# Altium project Guppy Buddy Rev B.PrjPCB (part 7 of 9)

## Sheet LCD.SchDoc: LCD
size Tabloid; ApprovedBy: NA; CompanyName: Cospan Design LLC; DrawnBy: David McCoy; Engineer: David McCoy; DocumentNumber: 11; Revision: A; SheetNumber: 11; SheetTotal: 18; Client: OSH; Project: Guppy Buddy; ProjectPrettyName: Guppy Buddy
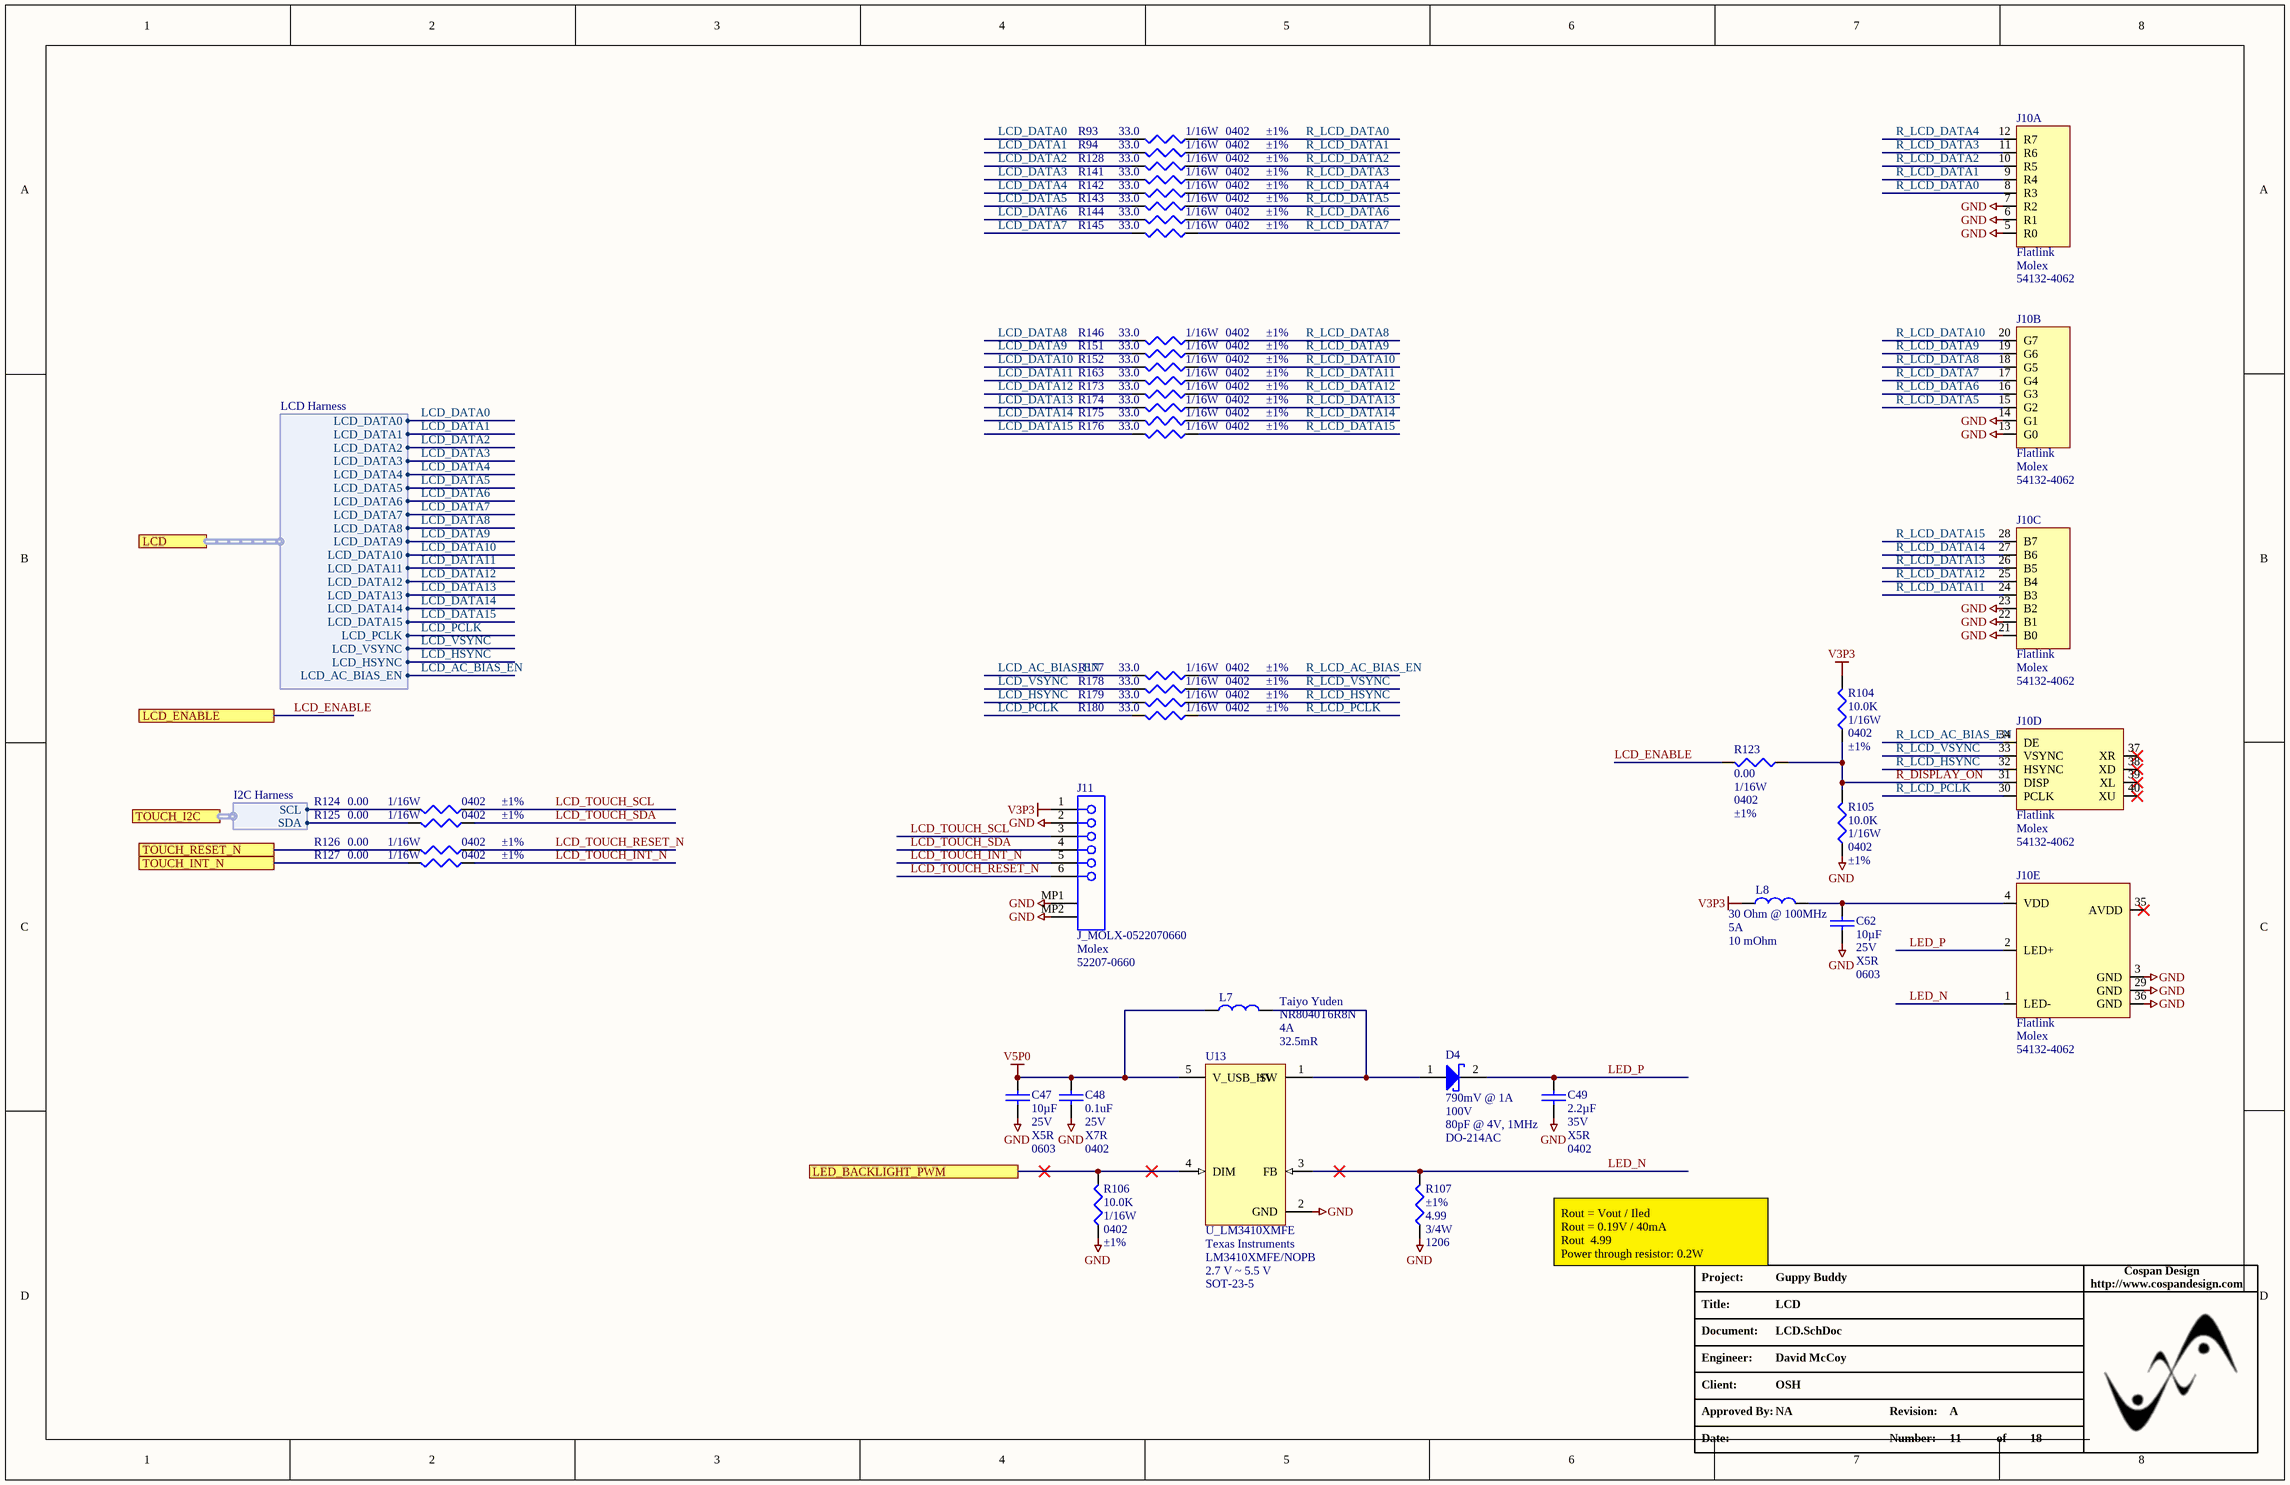
[diagram p10: LCD.SchDoc]

### Parts
C47  Capacitance: 10µF  Voltage - Rated: 25V  Temperature Coefficient: X5R  Package / Case: 0603  [C_ERA-0603]  (hidden comment: C_0603_10µF)
C48  Capacitance: 0.1uF  Voltage - Rated: 25V  Temperature Coefficient: X7R  Package / Case: 0402  [C_0402]  (hidden comment: C_0402_0.1UF_25V)
C49  Capacitance: 2.2µF  Voltage - Rated: 35V  Temperature Coefficient: X5R  Package / Case: 0402  [C_0402]  (hidden comment: C_0402_2.2uF_35V)
C62  Capacitance: 10µF  Voltage - Rated: 25V  Temperature Coefficient: X5R  Package / Case: 0603  [C_ERA-0603]  (hidden comment: C_0603_10µF)
D4  Voltage - Forward (Vf) (Max) @ If: 790mV @ 1A  Voltage - DC Reverse (Vr) (Max): 100V  Capacitance @ Vr, F: 80pF @ 4V, 1MHz  Package / Case: DO-214AC  [DIOM5226X23L]  (hidden comment: B1100-13-F)
J10  Flatlink  Manufacturer 1: Molex  Manufacturer Part Number 1: 54132-4062  [FPC_40PIN_BOTTOM]  (parts A,B,C,D,E of 5)
J11  J_MOLX-0522070660  Manufacturer 1: Molex  Manufacturer Part Number 1: 52207-0660  [MOLX-52271-0679]
L7  Manufacturer: Taiyo Yuden  Manufacturer Part Number: NR8040T6R8N  Max DC Current: 4A  DC Resistance (DCR): 32.5mR  [IND_TAIYO_NR8040]  (hidden comment: L_6.8µH_SHLD_4A)
L8  Impedance @ Frequency: 30 Ohm @ 100MHz  Current Rating (Max): 5A  DC Resistance (DCR) (Max): 10 mOhm  [R_0603]  (hidden comment: L_BEAD_0603_30OHM_100MHZ)
R93  Resistance In Ohms: 33.0  Power (Watts): 1/16W  Case: 0402  Tolerance: ±1%  [R_0402]  (hidden comment: R_0402_33)
R94  Resistance In Ohms: 33.0  Power (Watts): 1/16W  Case: 0402  Tolerance: ±1%  [R_0402]  (hidden comment: R_0402_33)
R104  Resistance In Ohms: 10.0K  Power (Watts): 1/16W  Case: 0402  Tolerance: ±1%  [R_0402]  (hidden comment: R_0402_10.0K)
R105  Resistance In Ohms: 10.0K  Power (Watts): 1/16W  Case: 0402  Tolerance: ±1%  [R_0402]  (hidden comment: R_0402_10.0K)
R106  Resistance In Ohms: 10.0K  Power (Watts): 1/16W  Case: 0402  Tolerance: ±1%  [R_0402]  (hidden comment: R_0402_10.0K)
R107  Tolerance: ±1%  Resistance In Ohms: 4.99  Power (Watts): 3/4W  Case: 1206  [R_1206]  (hidden comment: R_1206_4.99)
R123  Resistance In Ohms: 0.00  Power (Watts): 1/16W  Case: 0402  Tolerance: ±1%  [R_0402]  (hidden comment: 0.0 Ohms)
R124  Resistance In Ohms: 0.00  Power (Watts): 1/16W  Case: 0402  Tolerance: ±1%  [R_0402]  (hidden comment: 0.0 Ohms)
R125  Resistance In Ohms: 0.00  Power (Watts): 1/16W  Case: 0402  Tolerance: ±1%  [R_0402]  (hidden comment: 0.0 Ohms)
R126  Resistance In Ohms: 0.00  Power (Watts): 1/16W  Case: 0402  Tolerance: ±1%  [R_0402]  (hidden comment: 0.0 Ohms)
R127  Resistance In Ohms: 0.00  Power (Watts): 1/16W  Case: 0402  Tolerance: ±1%  [R_0402]  (hidden comment: 0.0 Ohms)
R128  Resistance In Ohms: 33.0  Power (Watts): 1/16W  Case: 0402  Tolerance: ±1%  [R_0402]  (hidden comment: R_0402_33)
R141  Resistance In Ohms: 33.0  Power (Watts): 1/16W  Case: 0402  Tolerance: ±1%  [R_0402]  (hidden comment: R_0402_33)
R142  Resistance In Ohms: 33.0  Power (Watts): 1/16W  Case: 0402  Tolerance: ±1%  [R_0402]  (hidden comment: R_0402_33)
R143  Resistance In Ohms: 33.0  Power (Watts): 1/16W  Case: 0402  Tolerance: ±1%  [R_0402]  (hidden comment: R_0402_33)
R144  Resistance In Ohms: 33.0  Power (Watts): 1/16W  Case: 0402  Tolerance: ±1%  [R_0402]  (hidden comment: R_0402_33)
R145  Resistance In Ohms: 33.0  Power (Watts): 1/16W  Case: 0402  Tolerance: ±1%  [R_0402]  (hidden comment: R_0402_33)
R146  Resistance In Ohms: 33.0  Power (Watts): 1/16W  Case: 0402  Tolerance: ±1%  [R_0402]  (hidden comment: R_0402_33)
R151  Resistance In Ohms: 33.0  Power (Watts): 1/16W  Case: 0402  Tolerance: ±1%  [R_0402]  (hidden comment: R_0402_33)
R152  Resistance In Ohms: 33.0  Power (Watts): 1/16W  Case: 0402  Tolerance: ±1%  [R_0402]  (hidden comment: R_0402_33)
R163  Resistance In Ohms: 33.0  Power (Watts): 1/16W  Case: 0402  Tolerance: ±1%  [R_0402]  (hidden comment: R_0402_33)
R173  Resistance In Ohms: 33.0  Power (Watts): 1/16W  Case: 0402  Tolerance: ±1%  [R_0402]  (hidden comment: R_0402_33)
R174  Resistance In Ohms: 33.0  Power (Watts): 1/16W  Case: 0402  Tolerance: ±1%  [R_0402]  (hidden comment: R_0402_33)
R175  Resistance In Ohms: 33.0  Power (Watts): 1/16W  Case: 0402  Tolerance: ±1%  [R_0402]  (hidden comment: R_0402_33)
R176  Resistance In Ohms: 33.0  Power (Watts): 1/16W  Case: 0402  Tolerance: ±1%  [R_0402]  (hidden comment: R_0402_33)
R177  Resistance In Ohms: 33.0  Power (Watts): 1/16W  Case: 0402  Tolerance: ±1%  [R_0402]  (hidden comment: R_0402_33)
R178  Resistance In Ohms: 33.0  Power (Watts): 1/16W  Case: 0402  Tolerance: ±1%  [R_0402]  (hidden comment: R_0402_33)
R179  Resistance In Ohms: 33.0  Power (Watts): 1/16W  Case: 0402  Tolerance: ±1%  [R_0402]  (hidden comment: R_0402_33)
R180  Resistance In Ohms: 33.0  Power (Watts): 1/16W  Case: 0402  Tolerance: ±1%  [R_0402]  (hidden comment: R_0402_33)
U13  U_LM3410XMFE  Manufacturer: Texas Instruments  Manufacturer Part Number: LM3410XMFE/NOPB  Voltage - Supply: 2.7 V ~ 5.5 V  Supplier Device Package: SOT-23-5  [MF05A_N]

### Ports
LCD (harness LCD Harness), LCD_ENABLE, LED_BACKLIGHT_PWM, TOUCH_I2C (harness I2C Harness), TOUCH_INT_N, TOUCH_RESET_N

### Harnesses
LCD Harness: LCD_DATA0, LCD_DATA1, LCD_DATA2, LCD_DATA3, LCD_DATA4, LCD_DATA5, LCD_DATA6, LCD_DATA7, LCD_DATA8, LCD_DATA9, LCD_DATA10, LCD_DATA11, LCD_DATA12, LCD_DATA13, LCD_DATA14, LCD_DATA15, LCD_PCLK, LCD_VSYNC, LCD_HSYNC, LCD_AC_BIAS_EN
I2C Harness: SCL, SDA

### Nets
GND: C47.1 C48.1 C49.1 C62.1 J10.3(GND) J10.5(R0) J10.6(R1) J10.7(R2) J10.13(G0) J10.14(G1) J10.21(B0) J10.22(B1) J10.23(B2) J10.29(GND) J10.36(GND) J11.2 J11.MP1 J11.MP2 R105.2 R106.2 R107.2 U13.2(GND)
V3P3: J11.1 L8.2 R104.1
V5P0: C47.2 C48.2 L7.1 U13.5(V_USB_HV)
I2C1_SCL: R124.1 ; port TOUCH_I2C.SCL
I2C1_SDA: R125.1 ; port TOUCH_I2C.SDA
LCD_AC_BIAS_EN: R177.1 ; port LCD.LCD_AC_BIAS_EN
LCD_DATA0: R93.1 ; port LCD.LCD_DATA0
LCD_DATA1: R94.1 ; port LCD.LCD_DATA1
LCD_DATA2: R128.1 ; port LCD.LCD_DATA2
LCD_DATA3: R141.1 ; port LCD.LCD_DATA3
LCD_DATA4: R142.1 ; port LCD.LCD_DATA4
LCD_DATA5: R143.1 ; port LCD.LCD_DATA5
LCD_DATA6: R144.1 ; port LCD.LCD_DATA6
LCD_DATA7: R145.1 ; port LCD.LCD_DATA7
LCD_DATA8: R146.1 ; port LCD.LCD_DATA8
LCD_DATA9: R151.1 ; port LCD.LCD_DATA9
LCD_DATA10: R152.1 ; port LCD.LCD_DATA10
LCD_DATA11: R163.1 ; port LCD.LCD_DATA11
LCD_DATA12: R173.1 ; port LCD.LCD_DATA12
LCD_DATA13: R174.1 ; port LCD.LCD_DATA13
LCD_DATA14: R175.1 ; port LCD.LCD_DATA14
LCD_DATA15: R176.1 ; port LCD.LCD_DATA15
LCD_ENABLE: R123.1 ; port LCD_ENABLE
LCD_HSYNC: R179.1 ; port LCD.LCD_HSYNC
LCD_PCLK: R180.1 ; port LCD.LCD_PCLK
LCD_TOUCH_INT_N: J11.5 R127.2
LCD_TOUCH_RESET_N: J11.6 R126.2
LCD_TOUCH_SCL: J11.3 R124.2
LCD_TOUCH_SDA: J11.4 R125.2
LCD_VSYNC: R178.1 ; port LCD.LCD_VSYNC
LED_BACKLIGHT_PWM: R106.1 U13.4(DIM) ; port LED_BACKLIGHT_PWM
LED_N: J10.1(LED-) R107.1 U13.3(FB)
LED_P: C49.2 D4.2(K) J10.2(LED+)
R_DISPLAY_ON: J10.31(DISP) R104.2 R105.1 R123.2
R_LCD_AC_BIAS_EN: J10.34(DE) R177.2
R_LCD_DATA0: J10.8(R3) R93.2
R_LCD_DATA1: J10.9(R4) R94.2
R_LCD_DATA2: J10.10(R5) R128.2
R_LCD_DATA3: J10.11(R6) R141.2
R_LCD_DATA4: J10.12(R7) R142.2
R_LCD_DATA5: J10.15(G2) R143.2
R_LCD_DATA6: J10.16(G3) R144.2
R_LCD_DATA7: J10.17(G4) R145.2
R_LCD_DATA8: J10.18(G5) R146.2
R_LCD_DATA9: J10.19(G6) R151.2
R_LCD_DATA10: J10.20(G7) R152.2
R_LCD_DATA11: J10.24(B3) R163.2
R_LCD_DATA12: J10.25(B4) R173.2
R_LCD_DATA13: J10.26(B5) R174.2
R_LCD_DATA14: J10.27(B6) R175.2
R_LCD_DATA15: J10.28(B7) R176.2
R_LCD_HSYNC: J10.32(HSYNC) R179.2
R_LCD_PCLK: J10.30(PCLK) R180.2
R_LCD_VSYNC: J10.33(VSYNC) R178.2
TOUCH_INT_N: R127.1 ; port TOUCH_INT_N
TOUCH_RESET_N: R126.1 ; port TOUCH_RESET_N
NetC62_2: C62.2 J10.4(VDD) L8.1
NetD4_1: D4.1(A) L7.2 U13.1(SW)

Not connected (* = marked no-connect by the designer): J10 35(AVDD)* 37(XR)* 38(XD)* 39(XL)* 40(XU)*

### Notes on the sheet
- Rout = Vout / Iled
  Rout = 0.19V / 40mA
  Rout  4.99
  Power through resistor: 0.2W
- Project:
- http://www.cospandesign.com
- Cospan Design
- Document:
- Engineer:
- Title:
- Client:
- Approved By:
- Revision:
- Date:
- Number:
- of

### Library data of the parts
C47 C62 = C_0603_10µF: CAP CER 10UF 16V X5R 0603; Manufacturer: Murata Electronics North America; Manufacturer Part Number: GRM188R61C106MA73D; Tolerance: ±20%; Supplier 1: Digi-Key; RoHS: RoHS Compliant; Category: Capacitors; Stock 1: 450536; Pricing 1: 1=0.35, 10=0.303, 50=0.184, 100=0.1516, 250=0.12124, 500=0.11042, 1000=0.09959 (USD); Packaging: Cut Tape (CT); Mounting Type: Surface Mount, MLCC; Operating Temperature: -55°C ~ 85°C; Applications: General Purpose; Ratings: -; Size / Dimension: 0.063" L x 0.031" W (1.60mm x 0.80mm); Height - Seated (Max): -; Thickness (Max): 0.031" (0.80mm); Lead Spacing: -; Features: -; Lead Style: -; ComponentLink1URL: http://www.murata.com/~/media/webrenewal/support/library/catalog/products/capacitor/mlcc/c02e.pdf; ComponentLink1Description: http://www.murata.com/~/media/webrenewal/support/library/catalog/products/capacitor/mlcc/c02e.pdf; Supplier Part Number 1: 490-7201-1-ND
C48 = C_0402_0.1UF_25V: CAP CER 0.1UF 25V X6S 0402; Manufacturer 1: Yageo; Manufacturer Part Number 1: CC0402KRX7R8BB104; Description 1: Cap Ceramic 0.1uF 25V X7R 10% SMD 0402 125C Paper T/R; Tolerance: 10%; Dissipation Factor: 3.5%; ComponentLink1URL: https://product.tdk.com/info/en/catalog/datasheets/mlcc_commercial_general_en.pdf; ComponentLink1Description: https://product.tdk.com/info/en/catalog/datasheets/mlcc_commercial_general_en.pdf; Supplier 1: Digi-Key; Supplier Part Number 1: 311-2077-1-ND; Stock 1: 0; Pricing 1: 1=0.1, 10=0.048, 100=0.0215, 500=0.01534, 1000=0.01205, 2500=0.01095, 5000=0.01007 (USD); Mount: Surface Mount; Case/Package: 0402; Case Code (Imperial): 0402; Case Code (Metric): 1005; Min Operating Temperature: -55°C; Max Operating Temperature: 125°C; Voltage Rating: 25V; Voltage Rating (DC): 25V; Packaging: Tape and Reel; Dielectric: X7R; Termination: SMD/SMT; Composition: Ceramic; Length: 1mm; Height: 0.5mm; Width: 0.02inch; Thickness: 0.022inch; Depth: 0.5mm; Radiation Hardening: No; Lead Free: Lead Free; Halogen Free: Halogen Free; ComponentLink2URL: https://datasheet.ciiva.com/11464/upy-gphc-x7r-6-3v-to-50v-8-11464889.pdf; ComponentLink2Description: https://datasheet.ciiva.com/11464/upy-gphc-x7r-6-3v-to-50v-8-11464889.pdf; ComponentLink3URL: https://datasheet.ciiva.com/13210/upy-gphc-x7r-6-3v-to-50v-8-12304-13210908.pdf; ComponentLink3Description: https://datasheet.ciiva.com/13210/upy-gphc-x7r-6-3v-to-50v-8-12304-13210908.pdf; ComponentLink4URL: https://datasheet.ciiva.com/17437/upy-gphc-x7r-6-3v-to-50v-8-17437357.pdf; ComponentLink4Description: https://datasheet.ciiva.com/17437/upy-gphc-x7r-6-3v-to-50v-8-17437357.pdf
C49 = C_0402_2.2uF_35V: CAP CER 2.2UF 35V 20% X5R 0402; Manufacturer: TDK Corporation; Manufacturer Part Number: C1005X5R1V225K050BC; Tolerance: ±10%; Supplier 1: Digi-Key; Supplier Part Number 1: 445-9028-1-ND; RoHS: RoHS Compliant; Category: Capacitors; Stock 1: 300469; Packaging: Cut Tape (CT); Mounting Type: Surface Mount, MLCC; Operating Temperature: -55°C ~ 85°C; Applications: General Purpose; Ratings: -; Size / Dimension: 0.039" L x 0.020" W (1.00mm x 0.50mm); Height - Seated (Max): -; Thickness (Max): 0.022" (0.55mm); Lead Spacing: -; Features: Low ESL; Lead Style: -; ComponentLink1URL: https://product.tdk.com/info/en/catalog/datasheets/mlcc_commercial_general_en.pdf; ComponentLink1Description: https://product.tdk.com/info/en/catalog/datasheets/mlcc_commercial_general_en.pdf; Pricing 1: 1=0.36, 10=0.253, 100=0.1518, 500=0.11386, 1000=0.09614, 2500=0.09108, 5000=0.08602 (USD); Part Status: Active; Failure Rate: -
D4 = D_SCHOTT_B1100-13-F: DIODE SCHOTTKY 100V 1A SMA; Manufacturer: Diodes Inc; Speed: Fast Recovery =< 500ns, > 200mA (Io); Current - Reverse Leakage @ Vr: 500µA @ 100V; Supplier 1: Digi-Key; Supplier Part Number 1: B1100-FDICT-ND; Manufacturer Part Number: B1100-13-F; RoHS: RoHS Compliant; Category: Discrete Semiconductor Products; Stock 1: 109264; Pricing: 1=0.57, 10=0.4, 25=0.3288, 100=0.2627, 250=0.1914, 500=0.15544, 1000=0.11948, 2500=0.1073 (USD); Diode Type: Schottky; Current - Average Rectified (Io): 1A; Reverse Recovery Time (trr): -; Mounting Type: Surface Mount; Supplier Device Package: SMA; Packaging: Cut Tape (CT); ComponentLink1URL: http://www.diodes.com/datasheets/ds30018.pdf; ComponentLink1Description: http://www.diodes.com/datasheets/ds30018.pdf; COST_1: *; COST_100: *; COST_1000: *; MANF1: *; MANF1_PN: *; MANF2: *; MANF2_PN: *; MANF3: *; MANF3_PN: *; VENDOR1: *; VENDOR1_PN: *
J10 = J_FPC_MOLEX_40POS: CONN FFC/FPC .50MM 40POS R/A SMD; Description 1: FFC & FPC Connectors 0.5 FPC Hsg AssyBtmW /AuPlt40CktEmbsTpPkg; Contact Resistance: 20mR; Current Rating: 500mA; Voltage Rating: 50V; Number of Positions: 40; Gender: Female; Mating Cycles: 20; Contact Location: Bottom; Stackable: No; Pitch: 0.5mm; ComponentLink1URL: http://www.molex.com/pdm_docs/sd/541324097_sd.pdf; ComponentLink1Description: http://www.molex.com/pdm_docs/sd/541324097_sd.pdf; Stock 1: 18264; Contact Material: Bronze; Contact Plating: Nickel,Gold; Housing Material: Thermoplastic; Colour: Black; Material: Bronze; Min Operating Temperature: -20°C; Max Operating Temperature: 85°C; Package Quantity: 1500; Number of Rows: 1; Packaging: Tape and Reel; Termination: Solder; Number of Contacts: 40; Orientation: Right Angle; Number of Circuits: 40; Radiation Hardening: No; Flammability Rating: UL94 V-0; REACH SVHC: No SVHC; ELV: Compliant; Lead Free: Lead Free; ComponentLink2URL: https://datasheet.ciiva.com/10366/0541324062-ffc-fpc-connectors-10366848.pdf; ComponentLink2Description: https://datasheet.ciiva.com/10366/0541324062-ffc-fpc-connectors-10366848.pdf; ComponentLink3URL: https://datasheet.ciiva.com/5136/0541324062-ffc-fpc-connectors-143955-5136808.pdf; ComponentLink3Description: https://datasheet.ciiva.com/5136/0541324062-ffc-fpc-connectors-143955-5136808.pdf; ComponentLink4URL: https://datasheet.ciiva.com/11745/0900766b80d5d226-11745087.pdf; ComponentLink4Description: https://datasheet.ciiva.com/11745/0900766b80d5d226-11745087.pdf; Supplier 1: Digi-Key; Supplier Part Number 1: WM3436DKR-ND; Pricing 1: 1=2.05, 10=1.861, 25=1.7472, 50=1.6712, 100=1.5953, 250=1.44336, 500=1.3294 (USD)
J11 = J_MOLX-0522070660: CONN FFC FPC TOP 6POS 1.00MM R/A; Description 1: CONNECTOR, FPC, 1.0MM, 6WAY; Contact Resistance: 20mR; Current Rating: 1A; Voltage Rating: 125V; Number of Positions: 6; Gender: Receptacle; Stackable: No; Pitch: 1mm; ComponentLink1URL: http://www.molex.com/pdm_docs/sd/522710479_sd.pdf; ComponentLink1Description: http://www.molex.com/pdm_docs/sd/522710479_sd.pdf; Stock 1: 5020; Contact Plating: Nickel,Gold; Contact Material: Bronze; Housing Colour: Natural; Housing Material: Nylon; Material: Bronze; Min Operating Temperature: -30°C; Max Operating Temperature: 85°C; Number of Rows: 1; Package Quantity: 1000; Packaging: Tape and Reel; Termination: SMD/SMT; Orientation: Right Angle; Number of Contacts: 6; Number of Circuits: 6; Length: 13.9mm; Depth: 8.9mm; Flammability Rating: UL94 V-0; REACH SVHC: Unknown; ELV: Compliant; ComponentLink2URL: https://datasheet.ciiva.com/16658/0522070660-ffc-fpc-connectors-16658853.pdf; ComponentLink2Description: https://datasheet.ciiva.com/16658/0522070660-ffc-fpc-connectors-16658853.pdf; ComponentLink3URL: https://datasheet.ciiva.com/1438/522071060-sd-1438423.pdf; ComponentLink3Description: https://datasheet.ciiva.com/1438/522071060-sd-1438423.pdf; ComponentLink4URL: https://datasheet.ciiva.com/26929/getdatasheetpartid-761355-26929848.pdf; ComponentLink4Description: https://datasheet.ciiva.com/26929/getdatasheetpartid-761355-26929848.pdf; ComponentLink5URL: https://datasheet.ciiva.com/5137/0522070660-ffc-fpc-connectors-149417-5137997.pdf; ComponentLink5Description: https://datasheet.ciiva.com/5137/0522070660-ffc-fpc-connectors-149417-5137997.pdf; ComponentLink6URL: https://datasheet.ciiva.com/11745/0900766b80d6d4e7-11745263.pdf; ComponentLink6Description: https://datasheet.ciiva.com/11745/0900766b80d6d4e7-11745263.pdf; Pricing 1: 1=0.94, 10=0.828, 25=0.7796, 50=0.7472, 100=0.7146, 250=0.64968, 500=0.5847 (USD); Supplier 1: Digi-Key; Supplier Part Number 1: WM10939DKR-ND
L7 = L_6.8µH_SHLD_4A: FIXED IND 6.8UH 3.7A 32.5 MOHM; Inductance: 6.8µH; Core Material: Ferrite; Self Resonant Frequency: 24MHz; Tolerance: 30%; Shielding: Shielded; Test Frequency: 100KHz; Supplier 1: Digikey; Stock 1: 11407; Pricing 1: 1=0.53, 10=0.46, 100=0.3283, 500=0.2758 (USD); Case/Package: Nonstandard; Number of Pins: 2; Min Operating Temperature: -25°C; Max Operating Temperature: 120°C; Packaging: Tape and Reel; Package Quantity: 1000; Current Rating: 3.7A; Saturation Current: 4A; Termination: SMD/SMT; Composition: Wirewound; Length: 0.315inch; Height: 4mm; Width: 8mm; Height - Seated (Max): 0.157inch; Depth: 8.2mm; Radiation Hardening: No; Lead Free: Lead Free; Halogen Free: Halogen Free; ComponentLink1URL: https://datasheet.ciiva.com/23806/1750159-23806706.pdf; ComponentLink1Description: https://datasheet.ciiva.com/23806/1750159-23806706.pdf; ComponentLink2URL: https://datasheet.ciiva.com/8502/nr8040t6r8n-ss-8502742.pdf; ComponentLink2Description: https://datasheet.ciiva.com/8502/nr8040t6r8n-ss-8502742.pdf; ComponentLink3URL: https://datasheet.ciiva.com/1045/wound04-e-1045225.pdf; ComponentLink3Description: https://datasheet.ciiva.com/1045/wound04-e-1045225.pdf; ComponentLink4URL: https://datasheet.ciiva.com/1045/wound04-e-1045226.pdf; ComponentLink4Description: https://datasheet.ciiva.com/1045/wound04-e-1045226.pdf; ComponentLink5URL: https://datasheet.ciiva.com/1045/wound04-e-1045227.pdf; ComponentLink5Description: https://datasheet.ciiva.com/1045/wound04-e-1045227.pdf; Supplier Part Number 1: 587-2000-6-ND
L8 = L_BEAD_0603_30OHM_100MHZ: FERRITE BEAD 30 OHM 0603; Manufacturer: TDK Corporation; Manufacturer Part Number: MPZ1608S300ATAH0; Filter Type: Power Line; Number of Lines: 1; Supplier 1: Digi-Key; RoHS: RoHS Compliant; Category: Filters; Stock 1: 25799; Pricing 1: 1=0.1, 10=0.079, 100=0.0472, 250=0.03432, 500=0.03146, 1000=0.02717 (USD); Packaging: Cut Tape (CT); Ratings: -; Operating Temperature: -55°C ~ 125°C; Package / Case: 0603 (1608 Metric); Mounting Type: Surface Mount; Height (Max): 0.030" (0.75mm); Size / Dimension: 0.063" L x 0.031" W (1.60mm x 0.80mm); ComponentLink1URL: https://product.tdk.com/info/en/catalog/datasheets/beads_commercial_power_mpz1608_en.pdf; ComponentLink1Description: https://product.tdk.com/info/en/catalog/datasheets/beads_commercial_power_mpz1608_en.pdf; Supplier Part Number 1: 445-1562-1-ND
R93 R94 R128 R141-R146 R151 R152 R163 R173-R180 = R_0402_33: RES 33.0 OHM 1/16W 1% 0402 SMD; Manufacturer: Yageo; Manufacturer Part Number: RC0402FR-0733RL; Resistance (Ohms): 33; Temperature Coefficient: ±100ppm/°C; Supplier 1: Digi-Key; Supplier Part Number 1: 311-33.0LRCT-ND; RoHS: RoHS Compliant; Category: Resistors; Stock 1: 733920; Pricing: 10=0.014, 50=0.0104, 100=0.0079, 250=0.00584, 500=0.00432, 1000=0.00288 (USD); Composition: Thick Film; Features: -; Size / Dimension: 0.039" L x 0.020" W (1.00mm x 0.50mm); Height: 0.014" (0.35mm); Number of Terminations: 2; Packaging: Cut Tape (CT); Package / Case: 0402 (1005 Metric); ComponentLink1URL: http://www.yageo.com/documents/recent/PYu-RC0402_51_RoHS_L_6.pdf; ComponentLink1Description: http://www.yageo.com/documents/recent/PYu-RC0402_51_RoHS_L_6.pdf
R104-R106 = R_0402_10.0K: RES 10.0K OHM 1/16W 1% 0402 SMD; Manufacturer: Stackpole Electronics Inc; Manufacturer Part Number: RMCF0402FT10K0; Resistance (Ohms): 10k; Temperature Coefficient: ±100ppm/°C; Supplier 1: Digi-Key; Supplier Part Number 1: RMCF0402FT10K0CT-ND; RoHS: RoHS Compliant; Category: Resistors; Stock 1: 234525; Pricing: 1=0.04, 10=0.025, 50=0.0138, 100=0.0105, 250=0.0078, 500=0.00576, 1000=0.00384, 2500=0.00324, 5000=0.0027 (USD); Composition: Thick Film; Features: -; Package / Case: 0402 (1005 Metric); Size / Dimension: 0.039" L x 0.020" W (1.00mm x 0.50mm); Height: 0.016" (0.40mm); Number of Terminations: 2; Packaging: Cut Tape (CT); ComponentLink1URL: http://www.seielect.com/Catalog/SEI-RMCF_RMCP.pdf; ComponentLink1Description: http://www.seielect.com/Catalog/SEI-RMCF_RMCP.pdf
R107 = R_1206_4.99: RES SMD 4.99 OHM 1% 3/4W 1206; Manufacturer: Vishay / Dale; Manufacturer Part Number: CRCW12064R99FKEAHP; Max Power Dissipation: 500mW; Temperature Coefficient: 100ppm/°C; Resistance: 4.99R; Supplier 1: Digikey; Stock 1: 24650; Pricing 1: 1=0.49, 10=0.375, 100=0.1577, 1000=0.087, 2500=0.0816 (USD); Case/Package: 1206; Case Code (Metric): 3216; Case Code (Imperial): 1206; Contact Plating: Tin; Min Operating Temperature: -55°C; Max Operating Temperature: 155°C; Packaging: Tape and Reel; Composition: Thick Film; Number of Terminations: 2; Length: 0.122inch; Height: 0.026inch; Width: 0.063inch; Lead Free: Lead Free; ComponentLink1URL: http://www.vishay.com/docs/20043/crcwhpe3.pdf; ComponentLink1Description: http://www.vishay.com/docs/20043/crcwhpe3.pdf; Supplier Part Number 1: 541-4.99UDKR-ND
R123-R127 = R_0402_0.00: RES 0.00 OHM 1/16W 1% 0402 SMD; Manufacturer: Yageo; Manufacturer Part Number: RC0402JR-070RL; Supplier 1: Digi-Key; RoHS: RoHS Compliant; Category: Resistors; Stock 1: 14041464; Pricing 1: 1=0.1, 10=0.01, 25=0.0068, 50=0.0052, 100=0.0038, 250=0.00288, 500=0.0023, 1000=0.0017, 5000=0.00122 (USD); Packaging: Cut Tape (CT); Part Status: Active; Composition: Thick Film; Features: Moisture Resistant; Temperature Coefficient: -; Operating Temperature: -55°C ~ 155°C; Package / Case: 0402 (1005 Metric); Supplier Device Package: 0402; Size / Dimension: 0.039" L x 0.020" W (1.00mm x 0.50mm); Height - Seated (Max): 0.016" (0.40mm); Failure Rate: -; ComponentLink1URL: http://www.yageo.com/documents/recent/PYu-RC_Group_51_RoHS_L_7.pdf; ComponentLink1Description: http://www.yageo.com/documents/recent/PYu-RC_Group_51_RoHS_L_7.pdf; Supplier Part Number 1: 311-0.0JRCT-ND
U13 = U_LM3410XMFE: IC DRVR WT/OLED BCKLT SOT23-5; Constant Current: Yes; Topology: PWM, SEPIC, Step-Up (Boost); Number of Outputs: 1; Type - Primary: Automotive, Backlight, Flash/Torch; Type - Secondary: High Brightness LED (HBLED), OLED, White LED; Frequency: 1.2MHz ~ 2MHz; Voltage - Output: 3 V ~ 24 V; Supplier 1: Digi-Key; Supplier Part Number 1: LM3410XMFE/NOPBCT-ND; RoHS: RoHS Compliant; Category: Integrated Circuits (ICs); Stock 1: 405; Pricing: 1=2.98, 10=2.67, 25=2.4012, 100=2.1839 (USD); Packaging: Cut Tape (CT); Constant Voltage: -; Internal Driver: Yes; Mounting Type: Surface Mount; Package / Case: SC-74A, SOT-753; Operating Temperature: -40°C ~ 125°C; ComponentLink1URL: http://www.ti.com/lit/ds/symlink/lm3410.pdf; ComponentLink1Description: http://www.ti.com/lit/ds/symlink/lm3410.pdf

## Sheet Cart.SchDoc: Cart
size Tabloid; ApprovedBy: NA; CompanyName: Cospan Design LLC; DrawnBy: David McCoy; Engineer: David McCoy; DocumentNumber: 12; Revision: A; SheetNumber: 12; SheetTotal: 18; Client: OSH; Project: Guppy Buddy; ProjectPrettyName: Guppy Buddy
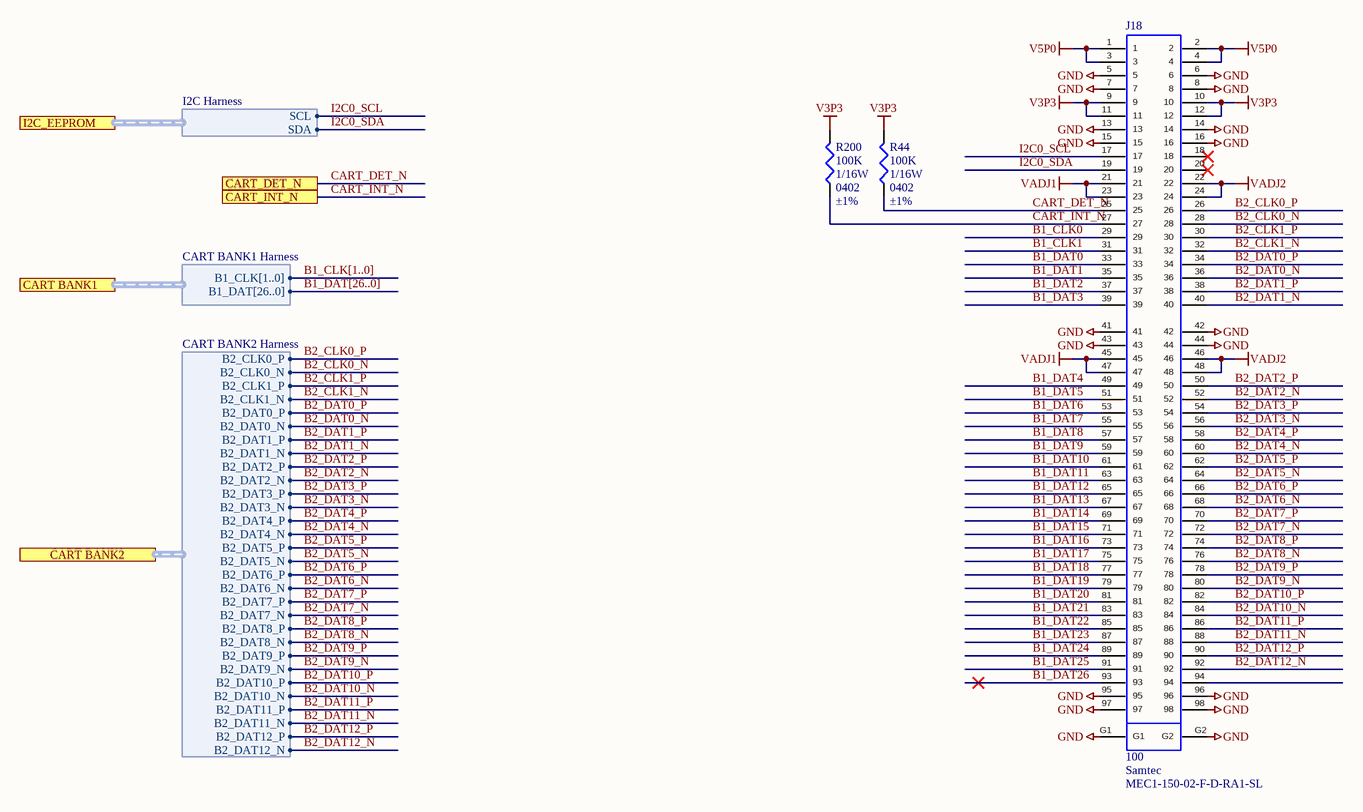
[diagram p11: Cart.SchDoc]

### Parts
J18  Number of Contacts: 100  Manufacturer 1: Samtec  Manufacturer Part Number 1: MEC1-150-02-F-D-RA1-SL  [MEC1-150-XX-XX-D-RAX-SL]  (hidden comment: J_MEC1-150-02-F-D-RA1-SL)
R44  Resistance In Ohms: 100K  Power (Watts): 1/16W  Case: 0402  Tolerance: ±1%  [R_0402]  (hidden comment: R_0402_100K)
R200  Resistance In Ohms: 100K  Power (Watts): 1/16W  Case: 0402  Tolerance: ±1%  [R_0402]  (hidden comment: R_0402_100K)

### Ports
CART BANK1 (harness CART BANK1 Harness), CART BANK2 (harness CART BANK2 Harness), CART_DET_N, CART_INT_N, I2C_EEPROM (harness I2C Harness)

### Harnesses
I2C Harness: SCL, SDA
CART BANK2 Harness: B2_CLK0_P, B2_CLK0_N, B2_CLK1_P, B2_CLK1_N, B2_DAT0_P, B2_DAT0_N, B2_DAT1_P, B2_DAT1_N, B2_DAT2_P, B2_DAT2_N, B2_DAT3_P, B2_DAT3_N, B2_DAT4_P, B2_DAT4_N, B2_DAT5_P, B2_DAT5_N, B2_DAT6_P, B2_DAT6_N, B2_DAT7_P, B2_DAT7_N, B2_DAT8_P, B2_DAT8_N, B2_DAT9_P, B2_DAT9_N, B2_DAT10_P, B2_DAT10_N, B2_DAT11_P, B2_DAT11_N, B2_DAT12_P, B2_DAT12_N
CART BANK1 Harness: B1_CLK[1..0], B1_DAT[26..0]

### Nets
GND: J18.5 J18.6 J18.7 J18.8 J18.13 J18.14 J18.15 J18.16 J18.41 J18.42 J18.43 J18.44 J18.95 J18.96 J18.97 J18.98 J18.G1 J18.G2
V3P3: J18.9 J18.10 J18.11 J18.12 R44.2 R200.2
V5P0: J18.1 J18.2 J18.3 J18.4
VADJ1: J18.21 J18.23 J18.45 J18.47
VADJ2: J18.22 J18.24 J18.46 J18.48
B1_CLK0: J18.29
B1_CLK1: J18.31
B1_DAT0: J18.33
B1_DAT1: J18.35
B1_DAT2: J18.37
B1_DAT3: J18.39
B1_DAT4: J18.49
B1_DAT5: J18.51
B1_DAT6: J18.53
B1_DAT7: J18.55
B1_DAT8: J18.57
B1_DAT9: J18.59
B1_DAT10: J18.61
B1_DAT11: J18.63
B1_DAT12: J18.65
B1_DAT13: J18.67
B1_DAT14: J18.69
B1_DAT15: J18.71
B1_DAT16: J18.73
B1_DAT17: J18.75
B1_DAT18: J18.77
B1_DAT19: J18.79
B1_DAT20: J18.81
B1_DAT21: J18.83
B1_DAT22: J18.85
B1_DAT23: J18.87
B1_DAT24: J18.89
B1_DAT25: J18.91
B1_DAT26: J18.93
B2_CLK0_N: J18.28 ; port CART BANK2.B2_CLK0_N
B2_CLK0_P: J18.26 ; port CART BANK2.B2_CLK0_P
B2_CLK1_N: J18.32 ; port CART BANK2.B2_CLK1_N
B2_CLK1_P: J18.30 ; port CART BANK2.B2_CLK1_P
B2_DAT0_N: J18.36 ; port CART BANK2.B2_DAT0_N
B2_DAT0_P: J18.34 ; port CART BANK2.B2_DAT0_P
B2_DAT1_N: J18.40 ; port CART BANK2.B2_DAT1_N
B2_DAT1_P: J18.38 ; port CART BANK2.B2_DAT1_P
B2_DAT2_N: J18.52 ; port CART BANK2.B2_DAT2_N
B2_DAT2_P: J18.50 ; port CART BANK2.B2_DAT2_P
B2_DAT3_N: J18.56 ; port CART BANK2.B2_DAT3_N
B2_DAT3_P: J18.54 ; port CART BANK2.B2_DAT3_P
B2_DAT4_N: J18.60 ; port CART BANK2.B2_DAT4_N
B2_DAT4_P: J18.58 ; port CART BANK2.B2_DAT4_P
B2_DAT5_N: J18.64 ; port CART BANK2.B2_DAT5_N
B2_DAT5_P: J18.62 ; port CART BANK2.B2_DAT5_P
B2_DAT6_N: J18.68 ; port CART BANK2.B2_DAT6_N
B2_DAT6_P: J18.66 ; port CART BANK2.B2_DAT6_P
B2_DAT7_N: J18.72 ; port CART BANK2.B2_DAT7_N
B2_DAT7_P: J18.70 ; port CART BANK2.B2_DAT7_P
B2_DAT8_N: J18.76 ; port CART BANK2.B2_DAT8_N
B2_DAT8_P: J18.74 ; port CART BANK2.B2_DAT8_P
B2_DAT9_N: J18.80 ; port CART BANK2.B2_DAT9_N
B2_DAT9_P: J18.78 ; port CART BANK2.B2_DAT9_P
B2_DAT10_N: J18.84 ; port CART BANK2.B2_DAT10_N
B2_DAT10_P: J18.82 ; port CART BANK2.B2_DAT10_P
B2_DAT11_N: J18.88 ; port CART BANK2.B2_DAT11_N
B2_DAT11_P: J18.86 ; port CART BANK2.B2_DAT11_P
B2_DAT12_N: J18.92 ; port CART BANK2.B2_DAT12_N
B2_DAT12_P: J18.90 ; port CART BANK2.B2_DAT12_P
CART_DET_N: J18.25 R44.1 ; port CART_DET_N
CART_INT_N: J18.27 R200.1 ; port CART_INT_N
I2C0_SCL: J18.17 ; port I2C_EEPROM.SCL
I2C0_SDA: J18.19 ; port I2C_EEPROM.SDA

Not connected (* = marked no-connect by the designer): J18 18* 20* 94

### Buses and harness runs
bus B1_CLK[1..0]
bus B1_DAT[26..0]

### Notes on the sheet
- Project:
- http://www.cospandesign.com
- Cospan Design
- Document:
- Engineer:
- Title:
- Client:
- Approved By:
- Revision:
- Date:
- Number:
- of

### Library data of the parts
J18 = J_MEC1-150-02-F-D-RA1-SL: 1MM MINI-EDGE CARD ASSEMBLY; Gender: Receptacle; Supplier 1: Digi-Key; Supplier Part Number 1: SAM12707-ND; Stock 1: 50; Pricing 1: 1=8.99, 10=8.602, 25=7.82, 50=7.429, 100=7.2335, 250=6.45152, 500=6.0605, 1000=5.3567 (USD); Mount: Surface Mount; Contact Plating: Gold; Contact Material: Bronze; Housing Colour: Black; Housing Material: Polymer; Min Operating Temperature: -55°C; Max Operating Temperature: 125°C; Packaging: Rail/Tube; Termination: Solder; Orientation: Right Angle; Pitch: 1mm; Radiation Hardening: No; REACH SVHC: No SVHC; Number of Rows: 2
R44 R200 = R_0402_100K: RES SMD 100K OHM 1% 1/16W 0402; Manufacturer: Yageo; Manufacturer Part Number: RC0402FR-07100KL; Temperature Coefficient: ±100ppm/°C; Supplier 1: Digi-Key; RoHS: RoHS Compliant; Category: Resistors; Stock 1: 4989982; Pricing 1: 1=0.1, 10=0.013, 25=0.0096, 100=0.0054, 250=0.00412, 500=0.00328, 1000=0.00242, 2500=0.0021, 5000=0.00173 (USD); Packaging: Cut Tape (CT); Resistance (Ohms): 100k; Composition: Thick Film; Features: Moisture Resistant; Operating Temperature: -55°C ~ 155°C; Package / Case: 0402 (1005 Metric); Supplier Device Package: 0402; Size / Dimension: 0.039" L x 0.020" W (1.00mm x 0.50mm); Height: 0.016" (0.40mm); Number of Terminations: 2; ComponentLink1URL: http://www.yageo.com/NewPortal/yageodocoutput?fileName=/pdf/R-Chip/PYu-RC_Group_51_RoHS_L_3.pdf; ComponentLink1Description: http://www.yageo.com/NewPortal/yageodocoutput?fileName=/pdf/R-Chip/PYu-RC_Group_51_RoHS_L_3.pdf; Supplier Part Number 1: 311-100KLRCT-ND

## Sheet Audio Codec.SchDoc: Audio Codec
size Tabloid; ApprovedBy: NA; CompanyName: Cospan Design LLC; DrawnBy: David McCoy; Engineer: David McCoy; DocumentNumber: 13; Revision: A; SheetNumber: 13; SheetTotal: 18; Client: OSH; Project: Guppy Buddy; ProjectPrettyName: Guppy Buddy
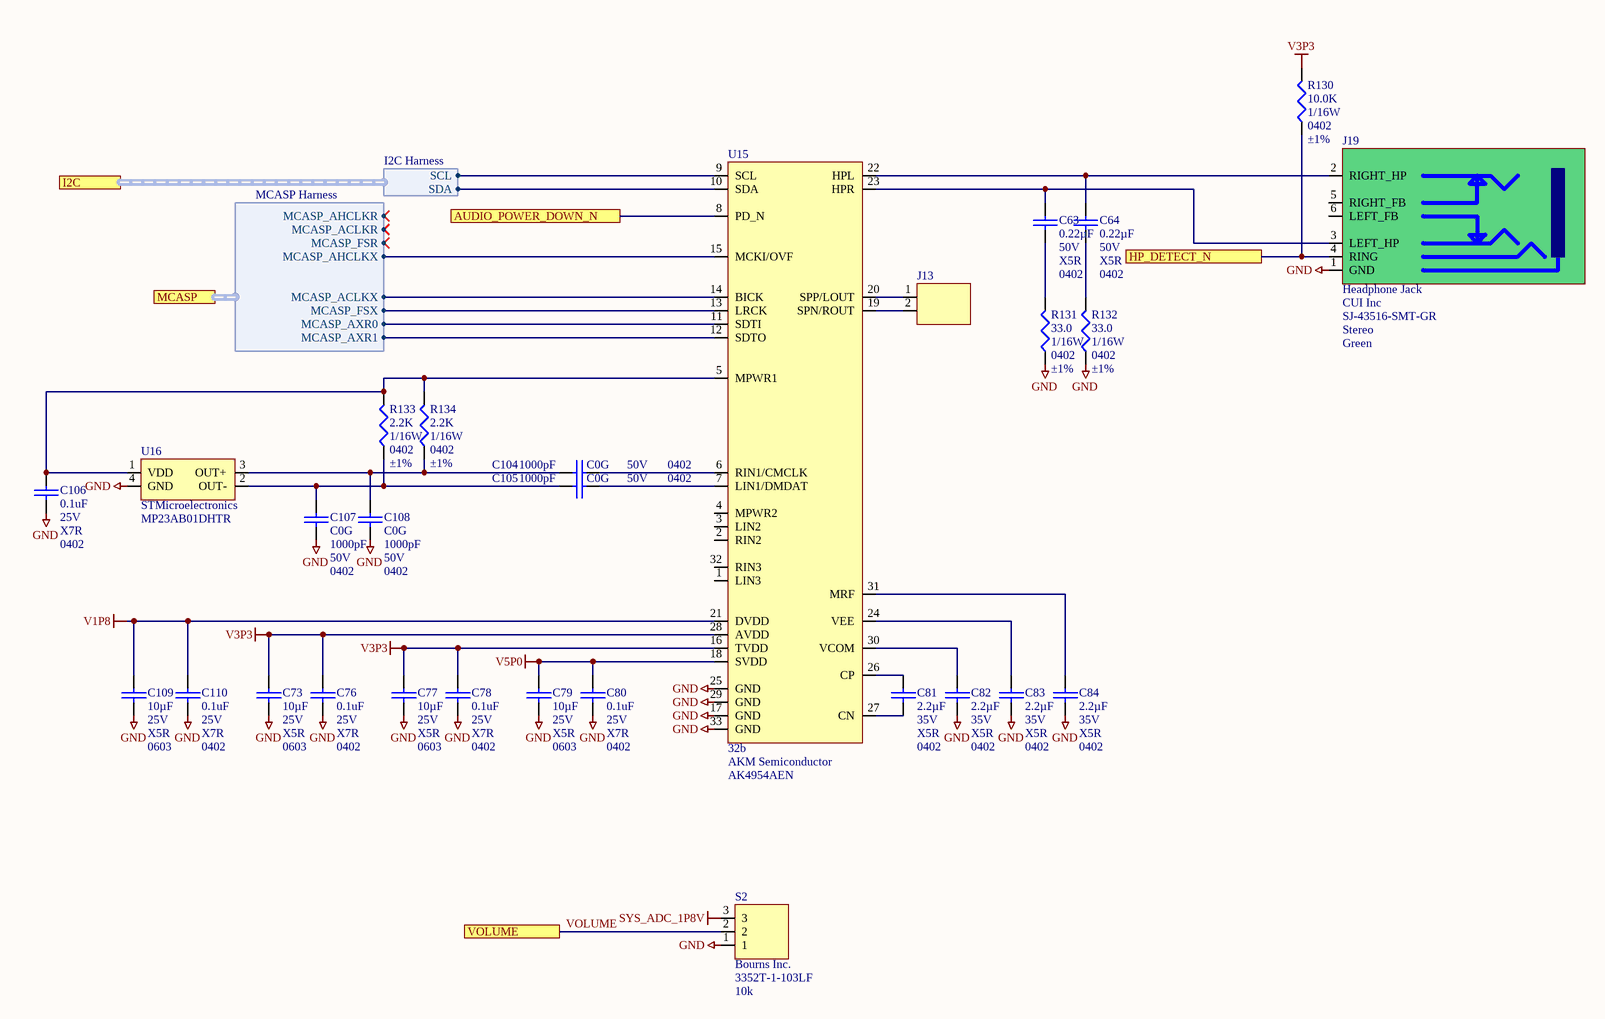
[diagram p12: Audio Codec.SchDoc]

### Parts
C63  Capacitance: 0.22µF  Voltage - Rated: 50V  Temperature Coefficient: X5R  Package / Case: 0402  [C_0402]  (hidden comment: C_0402_0.22UF_50V)
C64  Capacitance: 0.22µF  Voltage - Rated: 50V  Temperature Coefficient: X5R  Package / Case: 0402  [C_0402]  (hidden comment: C_0402_0.22UF_50V)
C73  Capacitance: 10µF  Voltage - Rated: 25V  Temperature Coefficient: X5R  Package / Case: 0603  [C_ERA-0603]  (hidden comment: C_0603_10µF)
C76  Capacitance: 0.1uF  Voltage - Rated: 25V  Temperature Coefficient: X7R  Package / Case: 0402  [C_0402]  (hidden comment: C_0402_0.1UF_25V)
C77  Capacitance: 10µF  Voltage - Rated: 25V  Temperature Coefficient: X5R  Package / Case: 0603  [C_ERA-0603]  (hidden comment: C_0603_10µF)
C78  Capacitance: 0.1uF  Voltage - Rated: 25V  Temperature Coefficient: X7R  Package / Case: 0402  [C_0402]  (hidden comment: C_0402_0.1UF_25V)
C79  Capacitance: 10µF  Voltage - Rated: 25V  Temperature Coefficient: X5R  Package / Case: 0603  [C_ERA-0603]  (hidden comment: C_0603_10µF)
C80  Capacitance: 0.1uF  Voltage - Rated: 25V  Temperature Coefficient: X7R  Package / Case: 0402  [C_0402]  (hidden comment: C_0402_0.1UF_25V)
C81  Capacitance: 2.2µF  Voltage - Rated: 35V  Temperature Coefficient: X5R  Package / Case: 0402  [C_0402]  (hidden comment: C_0402_2.2uF_35V)
C82  Capacitance: 2.2µF  Voltage - Rated: 35V  Temperature Coefficient: X5R  Package / Case: 0402  [C_0402]  (hidden comment: C_0402_2.2uF_35V)
C83  Capacitance: 2.2µF  Voltage - Rated: 35V  Temperature Coefficient: X5R  Package / Case: 0402  [C_0402]  (hidden comment: C_0402_2.2uF_35V)
C84  Capacitance: 2.2µF  Voltage - Rated: 35V  Temperature Coefficient: X5R  Package / Case: 0402  [C_0402]  (hidden comment: C_0402_2.2uF_35V)
C104  Temperature Coefficient: C0G  Voltage - Rated: 50V  Package / Case: 0402  [C_0402]  (hidden comment: 1000pF)
C105  Temperature Coefficient: C0G  Voltage - Rated: 50V  Package / Case: 0402  [C_0402]  (hidden comment: 1000pF)
C106  Capacitance: 0.1uF  Voltage - Rated: 25V  Temperature Coefficient: X7R  Package / Case: 0402  [C_0402]  (hidden comment: C_0402_0.1UF_25V)
C107  Temperature Coefficient: C0G  Voltage - Rated: 50V  Package / Case: 0402  [C_0402]  (hidden comment: 1000pF)
C108  Temperature Coefficient: C0G  Voltage - Rated: 50V  Package / Case: 0402  [C_0402]  (hidden comment: 1000pF)
C109  Capacitance: 10µF  Voltage - Rated: 25V  Temperature Coefficient: X5R  Package / Case: 0603  [C_ERA-0603]  (hidden comment: C_0603_10µF)
C110  Capacitance: 0.1uF  Voltage - Rated: 25V  Temperature Coefficient: X7R  Package / Case: 0402  [C_0402]  (hidden comment: C_0402_0.1UF_25V)
J13  2 Holes  [1X2_HOLES]  (value not drawn)  (no BOM)
J19  Headphone Jack  Manufacturer: CUI Inc  Manufacturer Part Number: SJ-43516-SMT-GR  Signal Lines: Stereo  Color: Green  [HEADPHONE_JACK]
R130  Resistance In Ohms: 10.0K  Power (Watts): 1/16W  Case: 0402  Tolerance: ±1%  [R_0402]  (hidden comment: R_0402_10.0K)
R131  Resistance In Ohms: 33.0  Power (Watts): 1/16W  Case: 0402  Tolerance: ±1%  [R_0402]  (hidden comment: R_0402_33)
R132  Resistance In Ohms: 33.0  Power (Watts): 1/16W  Case: 0402  Tolerance: ±1%  [R_0402]  (hidden comment: R_0402_33)
R133  Resistance In Ohms: 2.2K  Power (Watts): 1/16W  Case: 0402  Tolerance: ±1%  [R_0402]  (hidden comment: R_0402_2.2K)
R134  Resistance In Ohms: 2.2K  Power (Watts): 1/16W  Case: 0402  Tolerance: ±1%  [R_0402]  (hidden comment: R_0402_2.2K)
S2  Manufacturer: Bourns Inc.  Manufacturer Part Number: 3352T-1-103LF  Resistance (Ohms): 10k  [HDR_1X3_POT]  (hidden comment: SLIDE POT)
U15  Resolution: 32b  Manufacturer 1: AKM Semiconductor  Manufacturer Part Number 1: AK4954AEN  [QFN40P400X400X80_HS-33N]  (hidden comment: U_AK4954AEN)
U16  Manufacturer 1: STMicroelectronics  Manufacturer Part Number 1: MP23AB01DHTR  [RHLGA]  (hidden comment: U_MP23AB01DHTR)

### Ports
AUDIO_POWER_DOWN_N, HP_DETECT_N, I2C (harness I2C Harness), MCASP (harness MCASP Harness), VOLUME

### Harnesses
I2C Harness: SCL, SDA
MCASP Harness: MCASP_ACLKX, MCASP_FSX, MCASP_AXR0, MCASP_AHCLKR, MCASP_ACLKR, MCASP_FSR, MCASP_AXR1, MCASP_AHCLKX

### Nets
GND: C73.1 C76.1 C77.1 C78.1 C79.1 C80.1 C82.1 C83.1 C84.1 C106.1 C107.2 C108.2 C109.1 C110.1 J19.1(GND) R131.2 R132.2 S2.1 U15.17(GND) U15.25(GND) U15.29(GND) U15.33(GND) U16.4(GND)
SYS_ADC_1P8V: S2.3
V1P8: C109.2 C110.2 U15.21(DVDD)
V3P3: C73.2 C76.2 C77.2 C78.2 R130.1 U15.16(TVDD) U15.28(AVDD)
V5P0: C79.2 C80.2 U15.18(SVDD)
AUDIO_POWER_DOWN_N: U15.8(PD_N) ; port AUDIO_POWER_DOWN_N
HP_DETECT_N: J19.4(RING) R130.2 ; port HP_DETECT_N
I2C1_SCL: U15.9(SCL) ; port I2C.SCL
I2C1_SDA: U15.10(SDA) ; port I2C.SDA
MCASP0_ACLKX: U15.14(BICK) ; port MCASP.MCASP_ACLKX
MCASP0_AHCLKX: U15.15(MCKI/OVF) ; port MCASP.MCASP_AHCLKX
MCASP0_AXR0: U15.11(SDTI) ; port MCASP.MCASP_AXR0
MCASP0_AXR1: U15.12(SDTO) ; port MCASP.MCASP_AXR1
MCASP0_FSX: U15.13(LRCK) ; port MCASP.MCASP_FSX
VOLUME: S2.2 ; port VOLUME
NetC63_1: C63.1 R131.1
NetC63_2: C63.2 J19.3(LEFT_HP) U15.23(HPR)
NetC64_1: C64.1 R132.1
NetC64_2: C64.2 J19.2(RIGHT_HP) U15.22(HPL)
NetC81_1: C81.1 U15.27(CN)
NetC81_2: C81.2 U15.26(CP)
NetC82_2: C82.2 U15.30(VCOM)
NetC83_2: C83.2 U15.24(VEE)
NetC84_2: C84.2 U15.31(MRF)
NetC104_1: C104.1 U15.6(RIN1/CMCLK)
NetC104_2: C104.2 C108.1 R134.2 U16.3(OUT+)
NetC105_1: C105.1 U15.7(LIN1/DMDAT)
NetC105_2: C105.2 C107.1 R133.2 U16.2(OUT-)
NetC106_2: C106.2 R133.1 R134.1 U15.5(MPWR1) U16.1(VDD)
NetJ13_1: J13.1 U15.20(SPP/LOUT)
NetJ13_2: J13.2 U15.19(SPN/ROUT)

Not connected (* = marked no-connect by the designer): J19 5(RIGHT_FB) 6(LEFT_FB); U15 1(LIN3) 2(RIN2) 3(LIN2) 4(MPWR2) 32(RIN3)

### Notes on the sheet
- Project:
- http://www.cospandesign.com
- Cospan Design
- Document:
- Engineer:
- Title:
- Client:
- Approved By:
- Revision:
- Date:
- Number:
- of

### Library data of the parts
C63 C64 = C_0402_0.22UF_50V: CAP CER 0.22UF 50V X5R 0402; Manufacturer: Taiyo Yuden; Manufacturer Part Number: UMK105BJ224KV-F; Tolerance: ±10%; Supplier 1: Digi-Key; RoHS: RoHS Compliant; Category: Capacitors; Stock 1: 141424; Pricing 1: 1=0.35, 10=0.263, 50=0.1532, 100=0.1225, 250=0.08752, 500=0.0595, 1000=0.04813, 5000=0.03763 (USD); Packaging: Digi-Reel®; Mounting Type: Surface Mount, MLCC; Operating Temperature: -55°C ~ 85°C; Applications: General Purpose; Ratings: -; Size / Dimension: 0.039" L x 0.020" W (1.00mm x 0.50mm); Height - Seated (Max): -; Thickness (Max): 0.022" (0.55mm); Lead Spacing: -; Features: -; Lead Style: -; ComponentLink1URL: http://ds.yuden.co.jp/TYCOMPAS/ut/detail.do?productNo=UMK105BJ224KV-F&fileName=UMK105BJ224KV-F_SS&mode=specSheetDownload; ComponentLink1Description: http://ds.yuden.co.jp/TYCOMPAS/ut/detail.do?productNo=UMK105BJ224KV-F&fileName=UMK105BJ224KV-F_SS&mode=specSheetDownload; Supplier Part Number 1: 587-3500-6-ND
C73 C77 C79 C109 = C_0603_10µF: as C47 on sheet LCD; Supplier 1: Digi-Key; RoHS: RoHS Compliant; Category: Capacitors; Stock 1: 450536; Pricing 1: 1=0.35, 10=0.303, 50=0.184, 100=0.1516, 250=0.12124, 500=0.11042, 1000=0.09959 (USD); Packaging: Cut Tape (CT); Mounting Type: Surface Mount, MLCC; Operating Temperature: -55°C ~ 85°C; Applications: General Purpose; Ratings: -; Size / Dimension: 0.063" L x 0.031" W (1.60mm x 0.80mm); Height - Seated (Max): -; Thickness (Max): 0.031" (0.80mm); Lead Spacing: -; Features: -; Lead Style: -; ComponentLink1URL: http://www.murata.com/~/media/webrenewal/support/library/catalog/products/capacitor/mlcc/c02e.pdf; ComponentLink1Description: http://www.murata.com/~/media/webrenewal/support/library/catalog/products/capacitor/mlcc/c02e.pdf; Supplier Part Number 1: 490-7201-1-ND
C76 C78 C80 C106 C110 = C_0402_0.1UF_25V: as C48 on sheet LCD; ComponentLink1URL: https://product.tdk.com/info/en/catalog/datasheets/mlcc_commercial_general_en.pdf; ComponentLink1Description: https://product.tdk.com/info/en/catalog/datasheets/mlcc_commercial_general_en.pdf; Supplier 1: Digi-Key; Supplier Part Number 1: 311-2077-1-ND; Stock 1: 0; Pricing 1: 1=0.1, 10=0.048, 100=0.0215, 500=0.01534, 1000=0.01205, 2500=0.01095, 5000=0.01007 (USD); Mount: Surface Mount; Case/Package: 0402; Case Code (Imperial): 0402; Case Code (Metric): 1005; Min Operating Temperature: -55°C; Max Operating Temperature: 125°C; Voltage Rating: 25V; Voltage Rating (DC): 25V; Packaging: Tape and Reel; Dielectric: X7R; Termination: SMD/SMT; Composition: Ceramic; Length: 1mm; Height: 0.5mm; Width: 0.02inch; Thickness: 0.022inch; Depth: 0.5mm; Radiation Hardening: No; Lead Free: Lead Free; Halogen Free: Halogen Free; ComponentLink2URL: https://datasheet.ciiva.com/11464/upy-gphc-x7r-6-3v-to-50v-8-11464889.pdf; ComponentLink2Description: https://datasheet.ciiva.com/11464/upy-gphc-x7r-6-3v-to-50v-8-11464889.pdf; ComponentLink3URL: https://datasheet.ciiva.com/13210/upy-gphc-x7r-6-3v-to-50v-8-12304-13210908.pdf; ComponentLink3Description: https://datasheet.ciiva.com/13210/upy-gphc-x7r-6-3v-to-50v-8-12304-13210908.pdf; ComponentLink4URL: https://datasheet.ciiva.com/17437/upy-gphc-x7r-6-3v-to-50v-8-17437357.pdf; ComponentLink4Description: https://datasheet.ciiva.com/17437/upy-gphc-x7r-6-3v-to-50v-8-17437357.pdf
C81-C84 = C_0402_2.2uF_35V: as C49 on sheet LCD; Supplier 1: Digi-Key; RoHS: RoHS Compliant; Category: Capacitors; Stock 1: 300469; Pricing 1: 1=0.36, 10=0.253, 100=0.1518, 500=0.11386, 1000=0.09614, 2500=0.09108, 5000=0.08602 (USD); Packaging: Cut Tape (CT); Part Status: Active; Operating Temperature: -55°C ~ 85°C; Features: Low ESL; Ratings: -; Applications: General Purpose; Failure Rate: -; Mounting Type: Surface Mount, MLCC; Size / Dimension: 0.039" L x 0.020" W (1.00mm x 0.50mm); Height - Seated (Max): -; Thickness (Max): 0.022" (0.55mm); Lead Spacing: -; Lead Style: -; ComponentLink1URL: https://product.tdk.com/info/en/catalog/datasheets/mlcc_commercial_general_en.pdf; ComponentLink1Description: https://product.tdk.com/info/en/catalog/datasheets/mlcc_commercial_general_en.pdf; Supplier Part Number 1: 445-9028-1-ND
C104 C105 C107 C108 = C_0402_1000PF_50V: CAP CER 1000PF 50V C0G 0402; Manufacturer: Murata Electronics North America; Manufacturer Part Number: GRM1555C1H102JA01D; Tolerance: ±5%; Supplier 1: Digi-Key; RoHS: RoHS Compliant; Category: Capacitors; Stock 1: 1327660; Pricing 1: 10=0.073, 100=0.0429, 500=0.02476, 1000=0.01716 (USD); Mounting Type: Surface Mount, MLCC; Operating Temperature: -55°C ~ 125°C; Features: -; Applications: General Purpose; Ratings: -; Size / Dimension: 0.040" L x 0.020" W (1.00mm x 0.50mm); Lead Spacing: -; Thickness: 0.50mm; Packaging: Cut Tape (CT); Lead Style: -; ComponentLink1URL: http://search.murata.co.jp/Ceramy/image/img/PDF/ENG/GRM1555C1H102JA01.pdf; ComponentLink1Description: http://search.murata.co.jp/Ceramy/image/img/PDF/ENG/GRM1555C1H102JA01.pdf; Supplier Part Number 1: 490-3244-1-ND; Capacitance: 1000pF
J13 = J_1X2_HOLES
J19 = J_HEADPHONE_JACK: CONN AUDIO JACK 3.5MM 4COND SMD; Gender: Female; Plug/Mating Plug Diameter: 3.50mm (0.141", 1/8", Mini Plug) - Headphone; Number of Positions/Contacts: 4 Conductors, 6 Contacts; Internal Switch(s): Two Switches; Shielding: Unshielded; Supplier 1: Digi-Key; Supplier Part Number 1: CP-43516SJGRCT-ND; RoHS: RoHS Compliant; Category: Connectors, Interconnects; Stock 1: 3934; Pricing: 1=1.26, 10=0.982, 100=0.749, 500=0.59796 (USD); Connector Type: Phone Jack; Mounting Type: Surface Mount, Right Angle; Termination: Solder; Features: Board Guide; Packaging: Cut Tape (CT); ComponentLink1URL: http://products.cui.com/GetSpecForDigikey.aspx?MFGNum=SJ-43516-SMT; ComponentLink1Description: http://products.cui.com/GetSpecForDigikey.aspx?MFGNum=SJ-43516-SMT
R130 = R_0402_10.0K: as R104-R106 on sheet LCD; Supplier 1: Digi-Key; Supplier Part Number 1: RMCF0402FT10K0CT-ND; RoHS: RoHS Compliant; Category: Resistors; Stock 1: 234525; Pricing: 1=0.04, 10=0.025, 50=0.0138, 100=0.0105, 250=0.0078, 500=0.00576, 1000=0.00384, 2500=0.00324, 5000=0.0027 (USD); Composition: Thick Film; Features: -; Package / Case: 0402 (1005 Metric); Size / Dimension: 0.039" L x 0.020" W (1.00mm x 0.50mm); Height: 0.016" (0.40mm); Number of Terminations: 2; Packaging: Cut Tape (CT); ComponentLink1URL: http://www.seielect.com/Catalog/SEI-RMCF_RMCP.pdf; ComponentLink1Description: http://www.seielect.com/Catalog/SEI-RMCF_RMCP.pdf
R131 R132 = R_0402_33: as R93 on sheet LCD; Supplier 1: Digi-Key; Supplier Part Number 1: 311-33.0LRCT-ND; RoHS: RoHS Compliant; Category: Resistors; Stock 1: 733920; Pricing: 10=0.014, 50=0.0104, 100=0.0079, 250=0.00584, 500=0.00432, 1000=0.00288 (USD); Composition: Thick Film; Features: -; Size / Dimension: 0.039" L x 0.020" W (1.00mm x 0.50mm); Height: 0.014" (0.35mm); Number of Terminations: 2; Packaging: Cut Tape (CT); Package / Case: 0402 (1005 Metric); ComponentLink1URL: http://www.yageo.com/documents/recent/PYu-RC0402_51_RoHS_L_6.pdf; ComponentLink1Description: http://www.yageo.com/documents/recent/PYu-RC0402_51_RoHS_L_6.pdf
R133 R134 = R_0402_2.2K: RES SMD 2.2K OHM 1% 1/10W 0402; Manufacturer: Panasonic Electronic Components; Manufacturer Part Number: ERJ-2RKF2201X; Temperature Coefficient: ±100ppm/°C; Supplier 1: Digi-Key; RoHS: RoHS Compliant; Category: Resistors; Stock 1: 1256647; Pricing 1: 1=0.1, 50=0.015, 100=0.011, 250=0.0084, 500=0.00674, 1000=0.00496, 5000=0.00355 (USD); Packaging: Cut Tape (CT); Resistance (Ohms): 2.2k; Composition: Thick Film; Features: Automotive AEC-Q200; Operating Temperature: -55°C ~ 155°C; Package / Case: 0402 (1005 Metric); Supplier Device Package: 0402; Size / Dimension: 0.039" L x 0.020" W (1.00mm x 0.50mm); Height: 0.016" (0.40mm); Number of Terminations: 2; ComponentLink1URL: http://industrial.panasonic.com/www-cgi/jvcr13pz.cgi?E+PZ+3+AOA0002+ERJ2RKF2201X+7+WW; ComponentLink1Description: http://industrial.panasonic.com/www-cgi/jvcr13pz.cgi?E+PZ+3+AOA0002+ERJ2RKF2201X+7+WW; Supplier Part Number 1: P2.20KLCT-ND
S2 = S_3352T-1-103LF: POT 10K OHM THUMBWHEEL CERM ST; Power (Watts): 0.5W, 1/2W; Tolerance: ±20%; Number of Turns: Single; Adjustment Type: Top Adjustment; Supplier 1: Digi-Key; RoHS: RoHS Compliant; Category: Potentiometers, Variable Resistors; Stock 1: 2355; Pricing 1: 1=1.53, 10=1.35, 25=1.2152, 50=1.17, 100=1.125, 250=1.05752, 500=0.9, 1000=0.8325, 2500=0.72 (USD); Packaging: Bulk; Size / Dimension: Round - 0.350" Dia x 0.150" H (8.89mm x 3.81mm); Termination: PC Pins; Mounting Type: Through Hole; ComponentLink1URL: http://www.bourns.com/data/global/PDFs/3352.pdf; ComponentLink1Description: http://www.bourns.com/data/global/PDFs/3352.pdf; Supplier Part Number 1: 3352T-103LF-ND
U15 = U_AK4954AEN: IC STEREO CODEC 32BIT 32QFN; Interface: Serial; Supplier 1: Digi-Key; Supplier Part Number 1: 974-1065-1-ND; Description 1: IC STEREO CODEC 32BIT 32QFN; Stock 1: 0; Mount: Surface Mount; Min Operating Temperature: -30°C; Max Operating Temperature: 85°C; Packaging: Tape and Reel; ComponentLink1URL: http://www.akm.com/akm/en/file/datasheet/AK4954AEN.pdf; ComponentLink1Description: http://www.akm.com/akm/en/file/datasheet/AK4954AEN.pdf
U16 = U_MP23AB01DHTR: MIC MEMS ANALOG OMNI -38DB; Supplier 1: Digi-Key; Supplier Part Number 1: 497-17051-6-ND; Stock 1: 5150; Pricing 1: 1=1.59, 10=1.257, 100=1.0017, 500=0.84854, 1000=0.7975 (USD); ComponentLink1URL: http://www.farnell.com/datasheets/2310300.pdf; ComponentLink1Description: http://www.farnell.com/datasheets/2310300.pdf

## Sheet Power.SchDoc: Power
size Tabloid; ApprovedBy: NA; CompanyName: Cospan Design LLC; DrawnBy: David McCoy; Engineer: David McCoy; DocumentNumber: 15; Revision: A; SheetNumber: 15; SheetTotal: 18; Client: OSH; Project: Guppy Buddy; ProjectPrettyName: Guppy Buddy
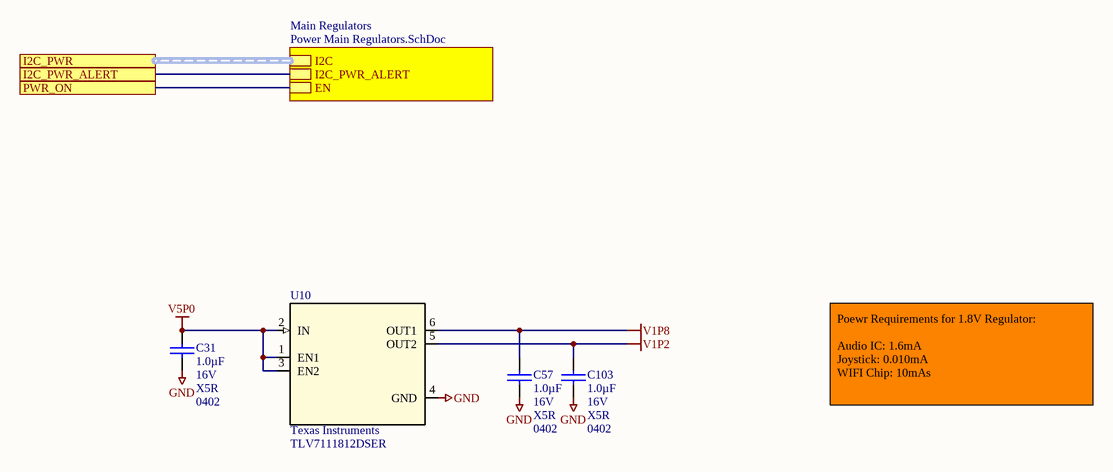
[diagram p13: Power.SchDoc]

### Parts
C31  Capacitance: 1.0µF  Voltage - Rated: 16V  Temperature Coefficient: X5R  Package / Case: 0402  [C_0402]  (hidden comment: 1.0uF)
C57  Capacitance: 1.0µF  Voltage - Rated: 16V  Temperature Coefficient: X5R  Package / Case: 0402  [C_0402]  (hidden comment: 1.0uF)
C103  Capacitance: 1.0µF  Voltage - Rated: 16V  Temperature Coefficient: X5R  Package / Case: 0402  [C_0402]  (hidden comment: 1.0uF)
U10  Manufacturer 1: Texas Instruments  Manufacturer Part Number 1: TLV7111812DSER  [DSE6]  (hidden comment: U_TLV7111812DSER)

### Sub-sheets
Main Regulators = Power Main Regulators.SchDoc: I2C (harness I2C Harness), I2C_PWR_ALERT, EN

### Ports
I2C_PWR (harness I2C Harness), I2C_PWR_ALERT, PWR_ON

### Nets
GND: C31.1 C57.1 C103.1 U10.4(GND)
V1P2: C103.2 U10.5(OUT2)
V1P8: C57.2 U10.6(OUT1)
V5P0: C31.2 U10.1(EN1) U10.2(IN) U10.3(EN2)
I2C_PWR_ALERT: port I2C_PWR_ALERT, sheet Main Regulators/I2C_PWR_ALERT
PWR_ON: port PWR_ON, sheet Main Regulators/EN

### Buses and harness runs
harness port I2C_PWR = sheet Main Regulators/I2C

### Notes on the sheet
- Poewr Requirements for 1.8V Regulator:
  Audio IC: 1.6mA
  Joystick: 0.010mA
  WIFI Chip: 10mAs
- Project:
- http://www.cospandesign.com
- Cospan Design
- Document:
- Engineer:
- Title:
- Client:
- Approved By:
- Revision:
- Date:
- Number:
- of

### Library data of the parts
C31 C57 C103 = C_0402_1.0UF_16V: CAP CER 1.0UF 16V X5R 0402; Manufacturer 1: Samsung; Manufacturer Part Number 1: CL05A105KO5NNNC; Tolerance: 10%; Description 1: Cap Ceramic 1uF 16V X5R 10% SMD 0402 85C Paper T/R; Supplier 1: Digi-Key; Stock 1: 26908; Pricing 1: 1=0.1, 10=0.062, 100=0.0276, 500=0.01968, 1000=0.01547, 2500=0.01406, 5000=0.01294 (USD); Packaging: Tape and Reel; ComponentLink1URL: http://ds.yuden.co.jp/TYCOMPAS/ut/detail.do?productNo=EMK105BJ105KV-F&fileName=EMK105BJ105KV-F_SS&mode=specSheetDownload; ComponentLink1Description: http://ds.yuden.co.jp/TYCOMPAS/ut/detail.do?productNo=EMK105BJ105KV-F&fileName=EMK105BJ105KV-F_SS&mode=specSheetDownload; Supplier Part Number 1: 1276-1067-6-ND; ComponentLink2URL: https://datasheet.ciiva.com/16207/cl05a105ko5nnnc-16207571.pdf; ComponentLink2Description: https://datasheet.ciiva.com/16207/cl05a105ko5nnnc-16207571.pdf; ComponentLink3URL: https://datasheet.ciiva.com/15195/getdatasheetpartid-355272-15195629.pdf; ComponentLink3Description: https://datasheet.ciiva.com/15195/getdatasheetpartid-355272-15195629.pdf; Mount: Surface Mount; Case/Package: 0402; Case Code (Metric): 1005; Case Code (Imperial): 0402; Contact Plating: Tin; Min Operating Temperature: -55°C; Max Operating Temperature: 85°C; Dielectric: X5R; Package Quantity: 1; Voltage Rating: 16V; Voltage: 16V; Length: 1mm; Height: 0.5mm; Width: 0.02inch; Thickness: 0.022inch; Depth: 0.5mm; Radiation Hardening: No
U10 = U_TLV7111812DSER: IC REG LDO 1.8V/1.2V 0.2A 6WSON; Built_By: EMA_UL_Team; Output Current: 200mA; Output Voltage: 1.2V; Max Input Voltage: 5.5V; Min Input Voltage: 2V; Number of Regulators: 2; Min Current Limit: 220mA; Power Supply Rejection Ratio (PSRR): 50dB; Quiescent Current: 30uA; Dropout Voltage: 175mV; Output Type: Fixed; Manufacturer_Part_Number: TLV7111812DSER; Vendor: Texas Instruments; RefDes: RefDes; Type: DEV; Value: Value; Description 1: IC REG LDO 1.8V/1.2V 0.2A 6WSON; Stock 1: 3457; Number of Pins: 6; Min Operating Temperature: -40°C; Max Operating Temperature: 125°C; Packaging: Tape and Reel; Package Quantity: 3000; Number of Outputs: 2; Lead Free: Lead Free; ComponentLink1URL: http://www.ti.com/lit/ds/symlink/tlv711.pdf; ComponentLink1Description: http://www.ti.com/lit/ds/symlink/tlv711.pdf; Supplier 1: Digi-Key; Supplier Part Number 1: 296-35050-6-ND; Pricing 1: 1=0.58, 10=0.51, 100=0.3909, 500=0.309, 1000=0.2472 (USD)